# EAGLE design hellobusnode (EAGLE 7.5.0)
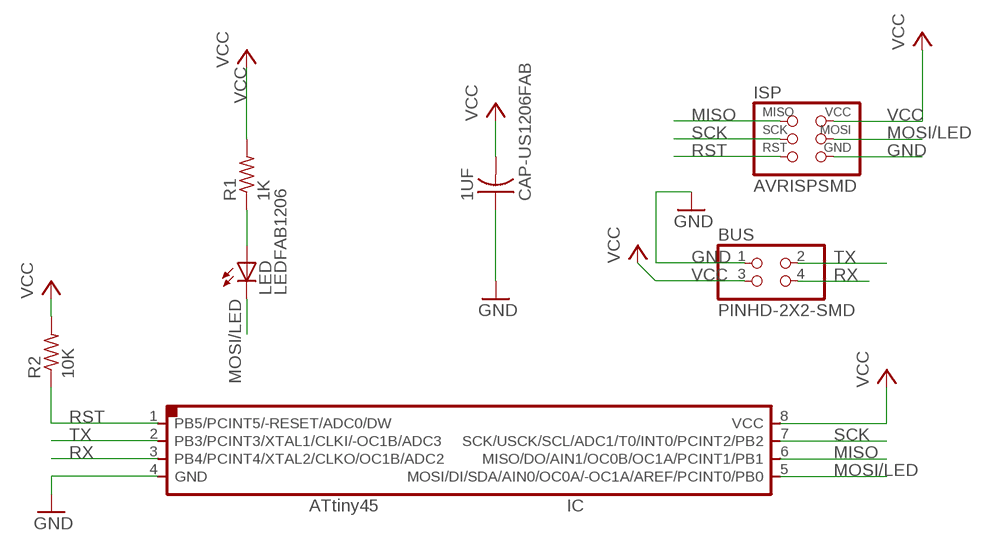
[diagram p0: schematic, sheet 1]

## Parts
1UF  CAP-US1206FAB  [C1206FAB]
BUS  PINHD-2X2-SMD  [2X02SMD]
IC  IC  ATTINY45SI  [SOIC8]
ISP  AVRISPSMD  [2X03SMD]
LED  LEDFAB1206  [LED1206FAB]
R1  1K  RES-US1206FAB  [R1206FAB]
R2  10K  RES-US1206FAB  [R1206FAB]

## Nets
GND: 1UF.1 BUS.1 IC.4(GND) ISP.6(GND)
MISO: IC.6(MISO/DO/AIN1/OC0B/OC1A/PCINT1/PB1) ISP.1(MISO)
MOSI/LED: IC.5(MOSI/DI/SDA/AIN0/OC0A/-OC1A/AREF/PCINT0/PB0) ISP.4(MOSI) LED.2(C)
N$1: LED.1(A) R1.1
RST: IC.1(PB5/PCINT5/-RESET/ADC0/DW) ISP.5(RST) R2.1
RX: BUS.4 IC.3(PB4/PCINT4/XTAL2/CLKO/OC1B/ADC2)
SCK: IC.7(SCK/USCK/SCL/ADC1/T0/INT0/PCINT2/PB2) ISP.3(SCK)
TX: BUS.2 IC.2(PB3/PCINT3/XTAL1/CLKI/-OC1B/ADC3)
VCC: 1UF.2 BUS.3 IC.8(VCC) ISP.2(VCC) R1.2 R2.2

## Library data of the parts
1UF = fab:CAP-US
BUS = fab:PINHD-2X2-SMD
IC = fab:ATTINY45
ISP = fab:AVRISP
LED = fab:LED: LED
R1 R2 = fab:RES-US: Resistor (US Symbol) Variants with postfix FAB are widened to allow the routing of internal traces

## Board
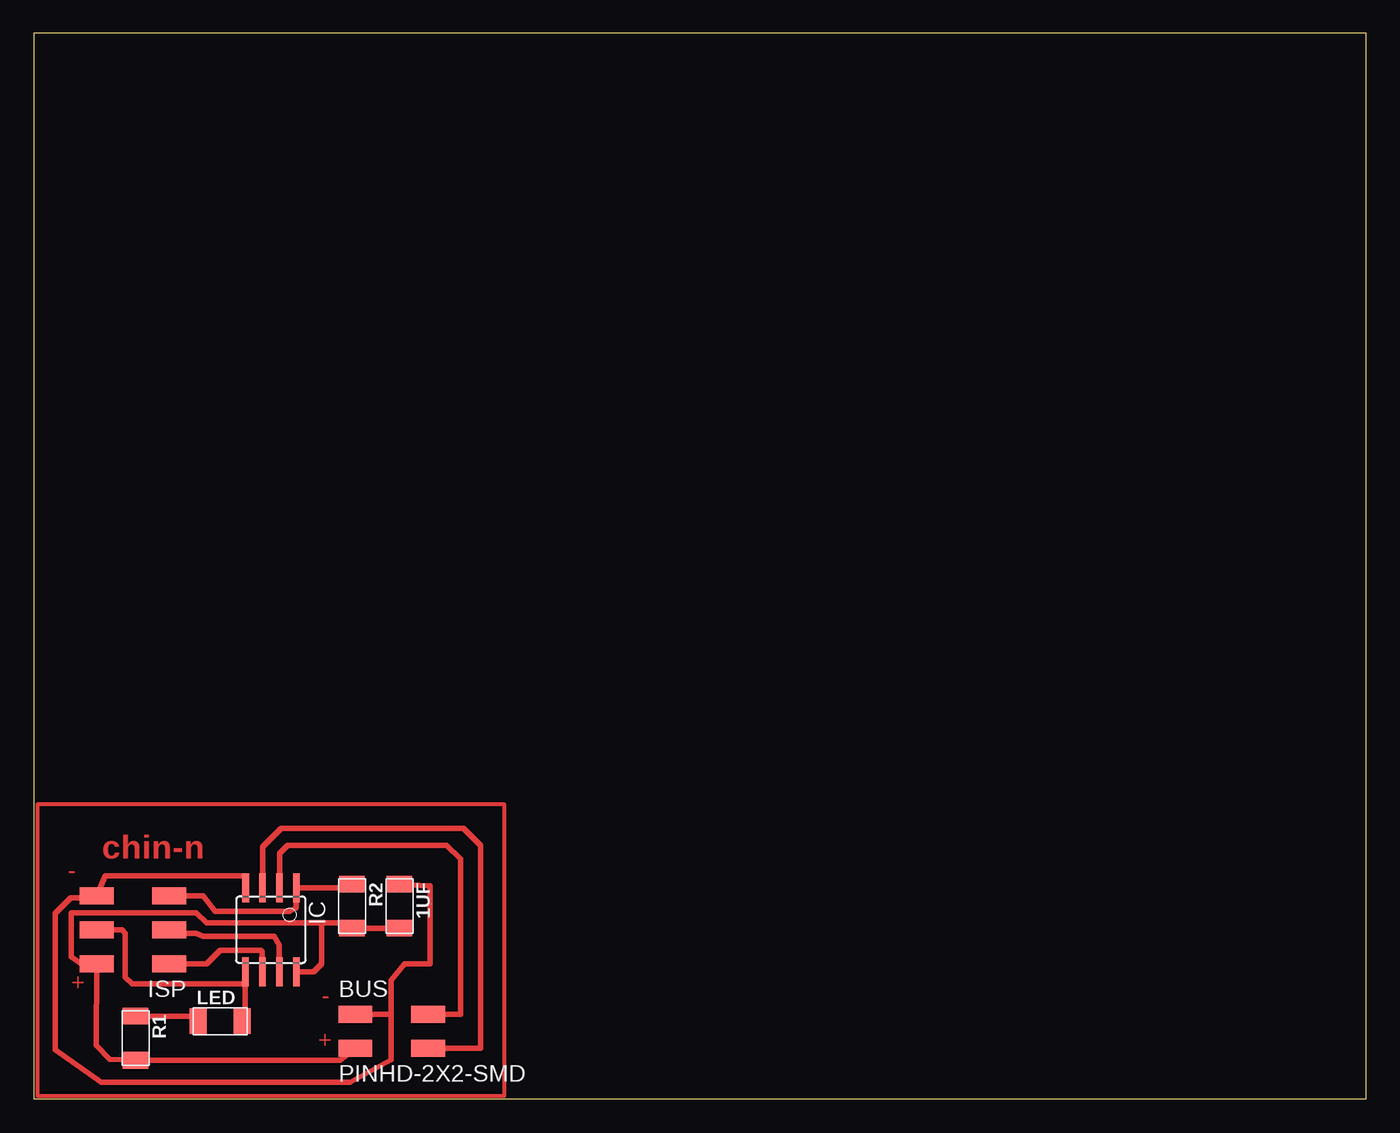
[diagram p1: board, top side]

Size 100 x 80 mm. Coordinates in mm from the lower left corner, seen from the top.
Outline: 0,0 100,0 100,80 0,80 0,0
Copper layers (1*16): Top 0.035mm / dielectric 1.5mm / Bottom 0.035mm
Design rules "default": minimum track width 10mil, minimum drill 24mil, track to track 8mil, track to pad 8mil, pad to pad 8mil, via to via 8mil, smd to smd 8mil, copper to edge 40mil, drill to drill 8mil, minimum pad ring 10mil, minimum via ring 8mil, stop-mask expansion 4mil, vias tented up to drill 0mil, thermal gap 10mil

### Footprints (pad centres in the part's own frame; a part is rotated, then mirrored left to right if it is on the bottom)
C1206FAB = smd 1.27 x 1.905: 1 -1.651,0; 2 1.651,0
2X02SMD = smd 2.54 x 1.27: 1 -2.54,1.27; 2 2.92,1.27; 3 -2.54,-1.27; 4 2.92,-1.27
SOIC8 = smd 0.5 x 2.2: 1 -1.905,-3.154; 2 -0.645,-3.154; 3 0.625,-3.154; 4 1.895,-3.154; 5 1.905,3.154; 6 0.635,3.154; 7 -0.635,3.154; 8 -1.905,3.154
2X03SMD = smd 2.54 x 1.27: 1 -2.54,2.54; 2 2.92,2.54; 3 -2.54,0; 4 2.92,0; 5 -2.54,-2.54; 6 2.92,-2.54
LED1206FAB = smd 1.27 x 1.905: 1 -1.651,0; 2 1.651,0
R1206FAB = smd 1.27 x 1.905: 1 -1.651,0; 2 1.651,0

### Placement (x,y rotation side)
1UF  27.43,14.48 270 top
BUS  26.67,5.08 0 top
IC  17.78,12.7 180 top
ISP  7.62,12.7 180 top
LED  13.97,5.84 0 top
R1  7.62,4.57 270 top
R2  23.88,14.48 270 top

### Tracks (layer width: path | path; a pad name or v marks a point on that pad's centre or on a via)
GND
  Top 0.254: 4.57,15.09 ISP.6
  Top 0.406: BUS.1 26.8,6.35 | 4.57,15.09 2.74,15.09 1.6,13.95 1.6,3.68 5.03,1.27 23.75,1.27 26.8,2.95 26.8,6.35 | 26.8,6.35 26.8,8.89 27.81,10.16 29.72,10.16 29.72,16 1UF.1 | IC.4 15.88,16.37 15.88,16.76 5.33,16.76 ISP.6
MISO
  Top 0.406: ISP.1 12.95,10.16 13.97,11.18 17.02,11.18 17.14,11.05 IC.6
MOSI/LED
  Top 0.406: ISP.4 6.6,12.7 6.86,12.45 6.86,9.14 7.37,8.64 15.85,8.64 | 15.85,8.64 15.85,5.97 LED.2 | IC.5 15.88,8.76 15.85,8.64
N$1
  Top 0.406: R1.1 11.81,6.22 12.7,5.33 12.7,5.46 LED.1
N$2
  Top 0.305: 0.25,0.25 35.31,0.25 35.31,22.1 0.25,22.1 0.25,0.25
RST
  Top 0.406: ISP.5 12.7,15.24 13.59,14.1 19.18,14.1 19.68,14.35 IC.1 23.6,15.85 R2.1
RX
  Top 0.406: IC.3 17.16,18.93 18.54,20.32 32.26,20.32 33.53,19.05 33.53,3.81 BUS.4
SCK
  Top 0.406: IC.7 18.41,11.56 18.03,12.19 12.7,12.19 12.19,12.45 10.41,12.45 ISP.3
TX
  Top 0.406: IC.2 18.43,18.43 19.05,19.05 30.99,19.05 32,18.03 32,6.35 BUS.2
VCC
  Top 0.406: 7.72,2.92 5.69,2.97 4.67,4.04 ISP.2 3.56,10.16 2.79,10.67 2.79,13.97 12.19,13.97 12.95,13.21 21.59,13.21 | R1.2 7.72,2.92 | 7.72,2.92 22.99,2.92 BUS.3 | 1UF.2 R2.2 23.9,13.21 21.59,13.21 | IC.8 20.98,9.55 21.59,10.16 21.59,13.21

### Text on the board
Top: chin-n | - | + | - | +